# EAGLE design BPSU_1.5 (EAGLE 6.5.0)
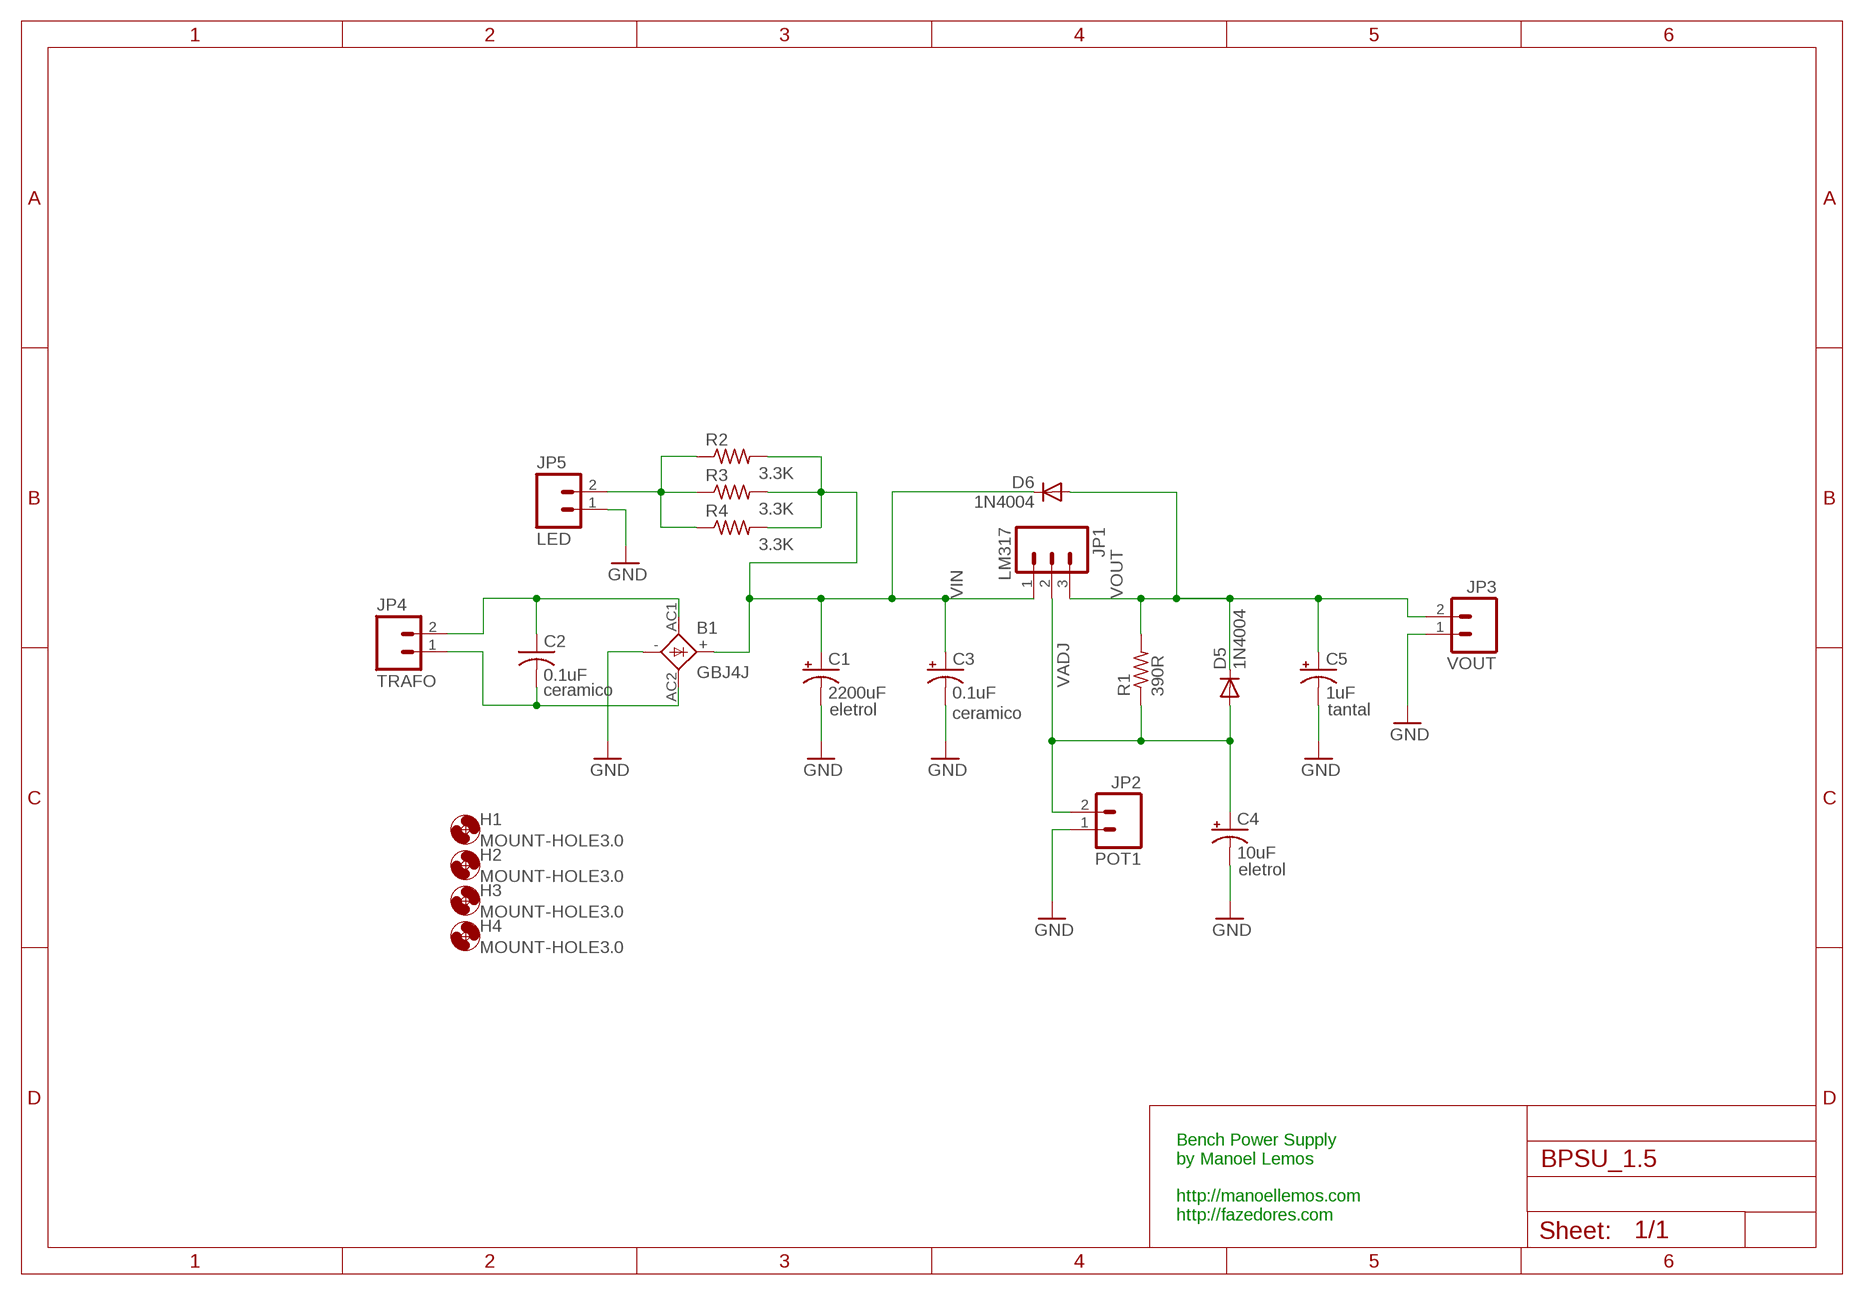
[diagram p0: schematic, sheet 1]

## Parts
B1  GBJ4J  [GBJ]
C1  2200uF  CPOL-USE7.5-18  [E7,5-18]
C2  0.1uF  C-US075-063X106  [C075-063X106]
C3  0.1uF  CPOL-USE3.5-8  [E3,5-8]
C4  10uF  CPOL-USE3.5-8  [E3,5-8]
C5  1uF  CPOL-USE3.5-8  [E3,5-8]
D5  1N4004  [DO41-10]
D6  1N4004  [DO41-10]
H1  MOUNT-HOLE3.0  [3,0]
H2  MOUNT-HOLE3.0  [3,0]
H3  MOUNT-HOLE3.0  [3,0]
H4  MOUNT-HOLE3.0  [3,0]
JP1  LM317  M03LONGPADS  [1X03_LONGPADS]
JP2  POT1  M02  [1X02_LONGPADS_ML]
JP3  VOUT  M02  [1X02_LONGPADS_ML]
JP4  TRAFO  M02  [1X02_LONGPADS_ML]
JP5  LED  M02  [1X02_LONGPADS_ML]
R1  390R  R-US_0204/7  [0204/7]
R2  3.3K  R-US_0204/7  [0204/7]
R3  3.3K  R-US_0204/7  [0204/7]
R4  3.3K  R-US_0204/7  [0204/7]

## Nets
GND [Ground]: B1.- C1.- C3.- C4.- C5.- JP2.1 JP3.1 JP5.1
N$1: JP5.2 R2.1 R3.1 R4.1
N$12 [Power]: B1.AC1 C2.1 JP4.2
N$13 [Power]: B1.AC2 C2.2 JP4.1
VADJ: C4.+ D5.A JP1.2 JP2.2 R1.1
VIN [Vin]: B1.+ C1.+ C3.+ D6.C JP1.1 R2.2 R3.2 R4.2
VOUT [Vout]: C5.+ D5.C D6.A JP1.3 JP3.2 R1.2

## Notes on the sheet
- ceramico
- eletrol | ceramico | tantal
- eletrol
- Bench Power Supply
  by Manoel Lemos
  
  http://manoellemos.com
  http://fazedores.com

## Library data of the parts
B1 = mlemos:GBJ4J
C1 C3-C5 = rcl:CPOL-US: POLARIZED CAPACITOR, American symbol
C2 = rcl:C-US: CAPACITOR, American symbol
D5 D6 = adafruit:1N4004: DIODE General purpose 1N400x type rectifier (With bigger pads) http://www.ladyada.net/library/pcb/eaglelibrary.html
H1-H4 = holes:MOUNT-HOLE: MOUNTING HOLE with drill center marker
JP1 = mlemos:M03: Header 3 Standard 3-pin 0.1" header. Use with straight break away headers (SKU : PRT-00116), right angle break away headers (PRT-00553), swiss pins (PRT-00743), machine pins (PRT-00117), and female headers (PRT-00115). Molex polarized connector foot print use with SKU : PRT-08232 with associated crimp pins and housings.
JP2-JP5 = mlemos:M02: Standard 2-pin 0.1" header. Use with - straight break away headers ( PRT-00116) - right angle break away headers (PRT-00553) - swiss pins (PRT-00743) - machine pins (PRT-00117) - female headers (PRT-00115) Molex polarized connector foot print use with: PRT-08233 with associated crimp pins and housings. 2.54_SCREWTERM for use with PRT-10571. 3.5mm Screw Terminal footprints for PRT-08084 5mm Screw Terminal footprints for use with PRT-08433
R1-R4 = rcl:R-US_: RESISTOR, American symbol

## Net classes
0 default: width 2.032 mm
1 Ground: width 2.54 mm
2 Power: width 3.175 mm
3 Vout: width 2.032 mm
4 Vin: width 2.032 mm

## Board
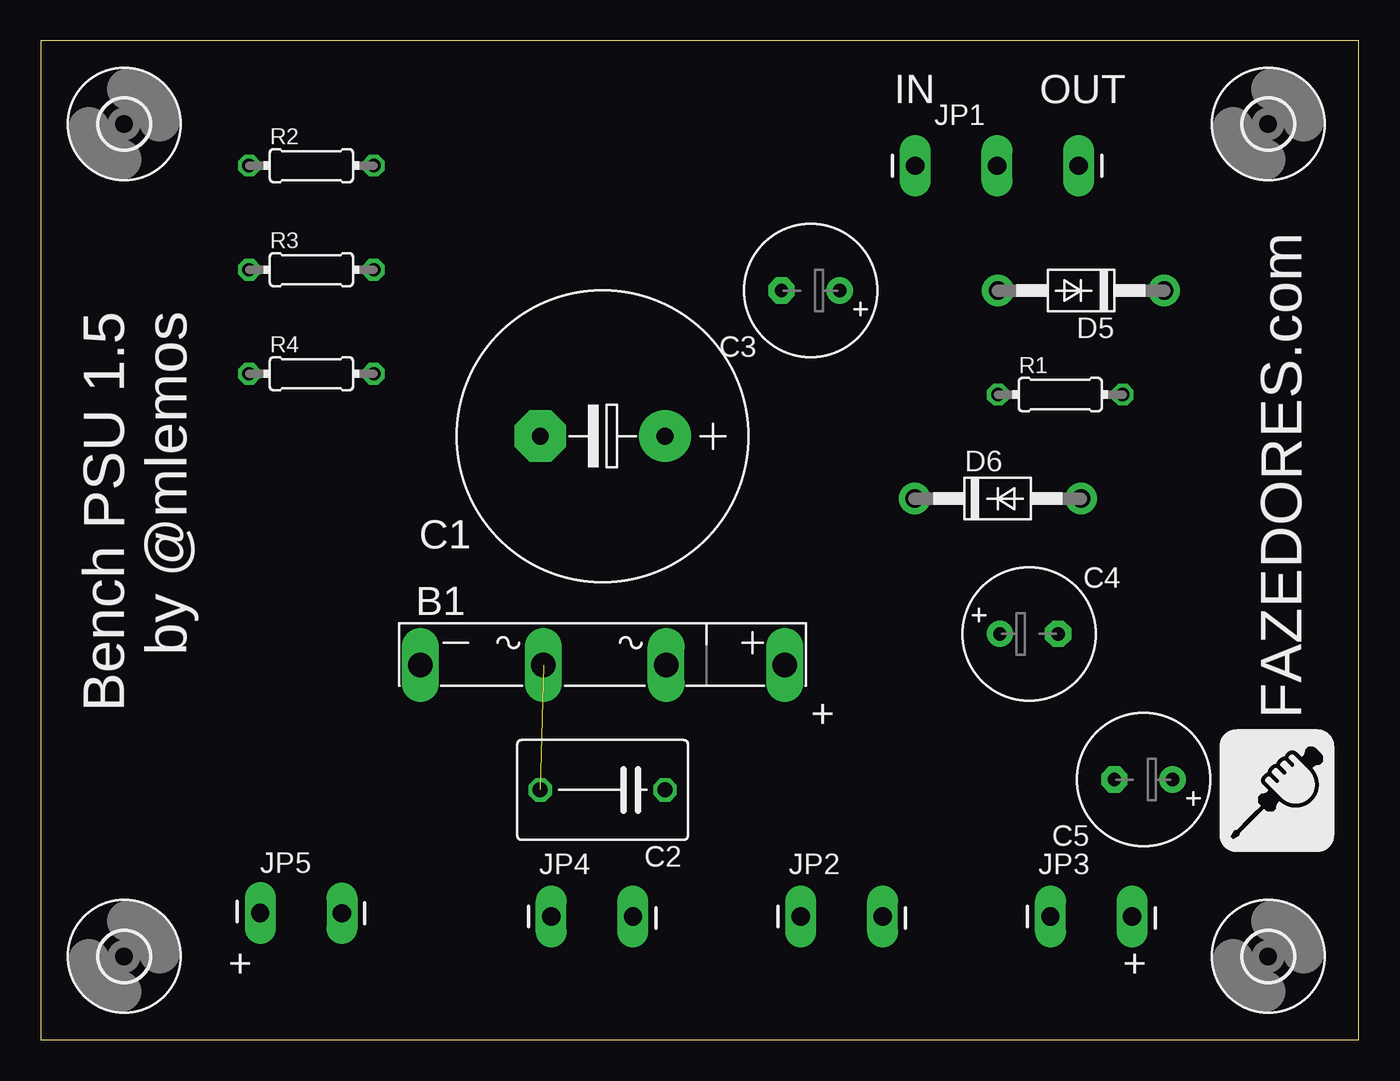
[diagram p1: board, top side]
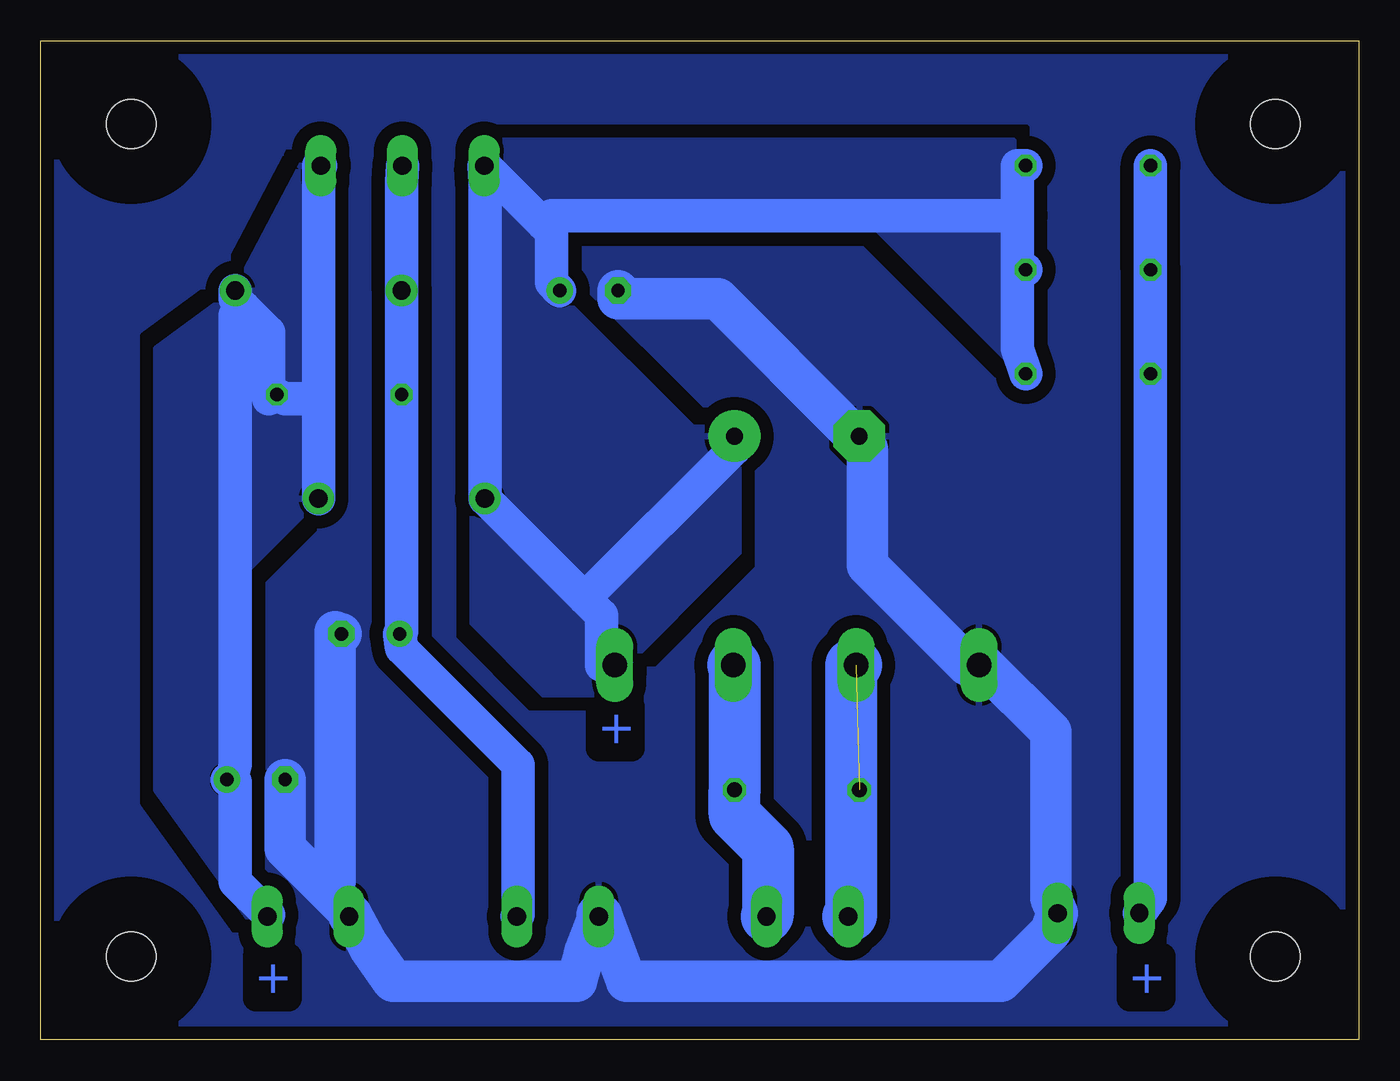
[diagram p2: board, bottom side, seen from below]

Size 80.44 x 60.95 mm. Coordinates in mm from the lower left corner, seen from the top.
Outline: 0,0 80.44,0 80.44,60.95 0,60.95 0,0
Copper layers (1*16): Top 0.035mm / dielectric 1.5mm / Bottom 0.035mm
Design rules "default *": minimum track width 10mil, minimum drill 24mil, track to track 15mil, track to pad 15mil, pad to pad 15mil, via to via 15mil, smd to smd 15mil, copper to edge 20mil, drill to drill 8mil, minimum pad ring 10mil, minimum via ring 8mil, stop-mask expansion 4mil, vias tented up to drill 0mil, thermal gap 10mil

### Footprints (pad centres in the part's own frame; a part is rotated, then mirrored left to right if it is on the bottom)
GBJ = drill 1.499 long: + 11.12,0; - -11.12,0; AC1 3.88,0; AC2 -3.62,0
E7,5-18 = drill 1.016 pad 3.15: + -3.81,0 | drill 1.016 pad 3.15 octagon: - 3.81,0
C075-063X106 = drill 0.914 octagon: 1 -3.81,0; 2 3.81,0
E3,5-8 = drill 0.813 pad 1.6: + -1.778,0 | drill 0.813 pad 1.6 octagon: - 1.778,0
DO41-10 = drill 1.118 pad 1.93: A 5.08,0; C -5.08,0
3,0 = hole 3: 0,0
1X03_LONGPADS = drill 1.118 pad 1.88 long: 1 -2.5,0; 2 2.494,-0.003; 3 7.48,0
1X02_LONGPADS_ML = drill 1.118 pad 1.88 long: 1 -3.14,-0.1; 2 1.854,-0.103
0204/7 = drill 0.813 octagon: 1 -3.81,0; 2 3.81,0

### Placement (x,y rotation side)
B1  34.29,22.86 0 top
C1  34.29,36.83 180 top
C2  34.29,15.24 180 top
C3  46.99,45.72 180 top
C4  60.32,24.77 0 top
C5  67.31,15.88 180 top
D5  63.5,45.72 180 top
D6  58.42,33.02 0 top
H1  5.08,5.08 0 top
H2  5.08,55.88 0 top
H3  74.93,55.88 0 top
H4  74.93,5.08 0 top
JP1  55.88,53.34 0 top
JP2  49.53,7.62 0 top
JP3  64.77,7.62 0 top
JP4  34.29,7.62 0 top
JP5  15.24,7.62 180 top
R1  62.23,39.37 0 top
R2  16.51,53.34 0 top
R3  16.51,46.99 0 top
R4  16.51,40.64 0 top
U$5  [LOGO_FAZEDORES_BIG_TSILK]  78.99,11.43 90 top

### Tracks (layer width: path | path; a pad name or v marks a point on that pad's centre or on a via)
GND
  Bottom 2.54: C5.- 65.53,11.68 62.99,9.14 | 61.47,7.62 62.99,9.14 | 61.47,7.62 JP3.1 | C4.- 62.48,24.89 62.48,9.65 62.99,9.14 | 61.47,7.62 60.45,5.71 58.93,3.56 47.75,3.56 47.26,5.27 arc5 47.22,5.4 JP2.1 46.48,7.62 46.23,7.62 44.7,3.56 21.84,3.56 18.8,6.6 JP5.1 18.8,8.64 18.8,18.8 22.86,22.86 B1.- 23.88,22.86 29.97,28.96 29.97,36.07 C1.- 30.99,37.08 39.12,45.21 45.21,45.21 C3.-
  pour Bottom (isolate 0.813, rank 2): 0,60.96 80.52,60.96 80.52,0 0,0
N$1
  Bottom 2.032: R2.1 R3.1 R4.1 12.7,8.64 JP5.2
N$12
  Bottom 3.175: B1.AC1 38.1,22.86 C2.1 38.1,13.72 36.07,11.68 36.07,7.62 JP4.2
N$13  (1 unrouted)
  Bottom 3.175: JP4.1 30.99,7.62 30.99,22.86 B1.AC2
VADJ
  Bottom 2.032: JP2.2 51.31,7.62 51.31,16.76 58.42,23.88 C4.+ 58.42,24.89 R1.1 D5.A 58.42,52.32 JP1.2
VIN
  Bottom 2.032: 20.83,47.24 20.83,42.16 R4.2 | 20.83,47.24 R3.2 | 20.83,47.24 20.83,50.29 | 20.83,50.29 20.83,53.34 R2.2 | 49.78,49.78 53.34,53.34 JP1.1 53.34,52.32 D6.C 47.24,26.92 | 49.78,49.78 49.28,49.28 49.28,46.23 C3.+ | 47.24,26.92 46.23,25.91 46.23,22.86 B1.+ | 47.24,26.92 38.1,36.07 C1.+ | 20.83,50.29 49.28,50.29 49.78,49.78
  pour Bottom (isolate 0.406): 21.08,54.86 53.34,54.86 54.1,53.34 54.1,25.4 49.78,21.08 45.72,21.08 45.47,21.34 45.47,22.1 37.85,29.72 37.85,37.08 38.1,37.34 40.64,37.34 48.77,45.47 48.77,50.04 29.97,50.04 20.57,40.64
VOUT
  Bottom 2.032: 68.82,15.81 68.58,15.75 68.58,9.65 66.55,7.62 JP3.2 | 68.82,15.81 C5.+ | 68.07,44.7 68.58,45.21 D5.C | 68.07,44.7 66.55,43.18 66.55,39.12 R1.2 65.53,39.12 63.5,39.12 | D6.A 63.5,39.12 | 63.5,39.12 63.5,53.34 JP1.3 | 68.82,15.81 68.58,16.76 68.58,44.2 68.07,44.7
  pour Bottom (isolate 0.406): 63.75,54.86 68.58,45.72 73.41,42.16 73.41,15.24 66.8,6.1 66.55,8.38 66.8,8.38 68.83,10.41 68.83,27.69 63.5,33.02

### Text on the board
Bottom: + | + | +
tPlace: IN | OUT | FAZEDORES.com | Bench PSU 1.5 / by @mlemos | + | + | +